# Altium schematic sheet Relay Control.SchDoc
size A2; SheetNumber: 1; SheetTotal: 1
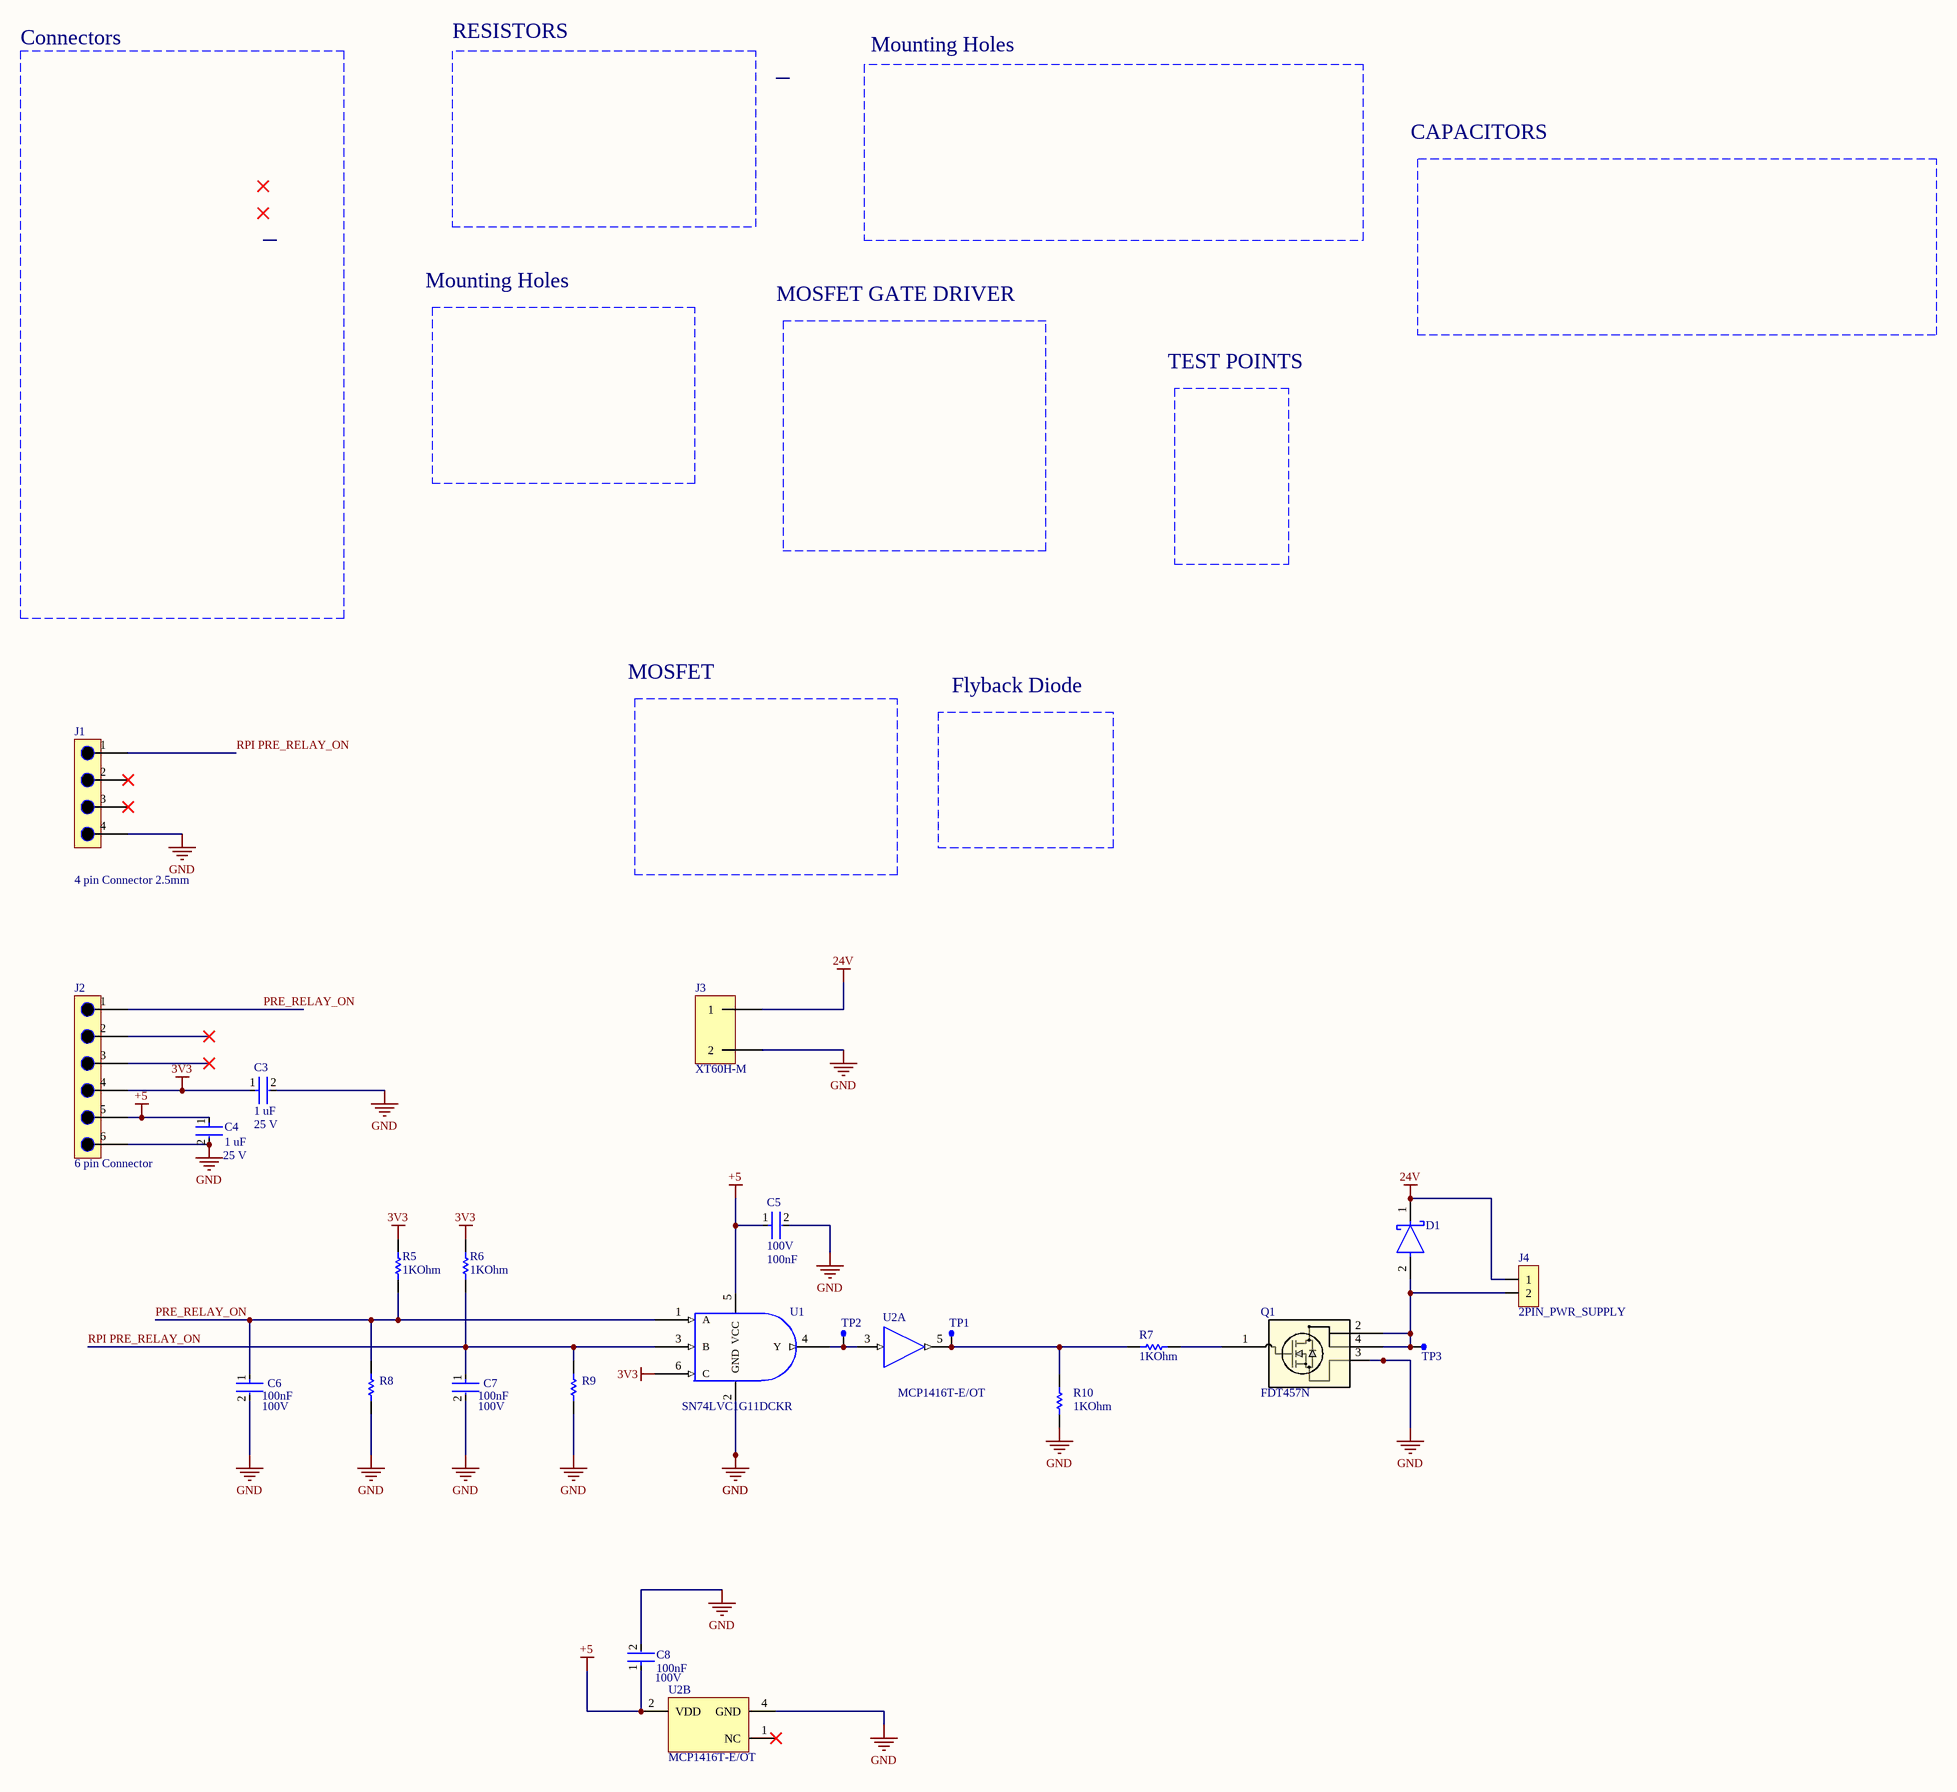
[diagram p0: Relay Control.SchDoc]

## Parts
C3  Capacitance: 1 uF  Voltage Rating: 25 V  [FP-CC0805-0_85-MFG]  (hidden comment: CC0805KKX7R8BB105)
C4  Capacitance: 1 uF  Voltage Rating: 25 V  [FP-CC0805-0_85-MFG]  (hidden comment: CC0805KKX7R8BB105)
C5  Voltage Rating: 100V  Capacitance: 100nF  [FP-0805-L_2_0_0_1-W_1_25-MFG]  (hidden comment: HMK212B7104MG-T)
C6  Voltage Rating: 100V  Capacitance: 100nF  [FP-0805-L_2_0_0_1-W_1_25-MFG]  (hidden comment: HMK212B7104MG-T)
C7  Voltage Rating: 100V  Capacitance: 100nF  [FP-0805-L_2_0_0_1-W_1_25-MFG]  (hidden comment: HMK212B7104MG-T)
C8  Voltage Rating: 100V  Capacitance: 100nF  [FP-0805-L_2_0_0_1-W_1_25-MFG]  (hidden comment: HMK212B7104MG-T)
D1  NRVBSS14HE  [FP-477AD-MFG]  (value not drawn)
J1  4 pin Connector 2.5mm  [4 PIN CONNECTOR 2.5MM]
J2  6 pin Connector  [PLEASEWORK - 6 Pin connector 2.5mm spacing]
J3  XT60H-M  [XT60H-M]
J4  2PIN_PWR_SUPPLY  [2PIN_JST_CONNECTOR]
Q1  FDT457N  [FDT457N MOSFET]
R5  Resistance: 1KOhm  [RESC2013X60X35NL10T20]  (hidden comment: RC0805FR-071KL)
R6  Resistance: 1KOhm  [RESC2013X60X35NL10T20]  (hidden comment: RC0805FR-071KL)
R7  Resistance: 1KOhm  [RESC2013X60X35NL10T20]  (hidden comment: RC0805FR-071KL)
R8  RC0805FR-0710KL  [RESC2013X60X35NL10T20]  (value not drawn)
R9  RC0805FR-0710KL  [RESC2013X60X35NL10T20]  (value not drawn)
R10  Resistance: 1KOhm  [RESC2013X60X35NL10T20]  (hidden comment: RC0805FR-071KL)
TP1  TEST_POINT  [TEST_POINT]  (value not drawn)
TP2  TEST_POINT  [TEST_POINT]  (value not drawn)
TP3  TEST_POINT  [TEST_POINT]  (value not drawn)
U1  SN74LVC1G11DCKR  [AND GATE]
U2  MCP1416T-E/OT  [SOT-23-OT5_M]  (parts A,B of 2)

## Nets
3V3: C3.1 J2.4 R5.1 R6.1 U1.6(C)
24V: D1.1(C) J3.1 J4.1
+5: C4.1 C5.1 C8.1 J2.5 U1.5(VCC) U2.2(VDD)
GND: C3.2 C4.2 C5.2 C6.2 C7.2 C8.2 J1.4 J2.6 J3.2 Q1.3 R8.1 R9.1 R10.1 U1.2(GND) U2.4(GND)
PRE_RELAY_ON: C6.1 J2.1 R5.2 R8.2 U1.1(A)
RPI PRE_RELAY_ON: C7.1 J1.1 R6.2 R9.2 U1.3(B)
NetD1_2: D1.2(A) J4.2 Q1.2 Q1.4 TP3.1
NetQ1_1: Q1.1 R7.1
NetR7_2: R7.2 R10.2 TP1.1 U2.5(OUT)
NetTP2_1: TP2.1 U1.4(Y) U2.3(IN)

Not connected (* = marked no-connect by the designer): J1 2* 3*; J2 2* 3*; U2 1(NC)*

## Notes on the sheet
- Connectors
- RESISTORS
- Mounting Holes
- CAPACITORS
- MOSFET GATE DRIVER
- TEST POINTS
- MOSFET
- Flyback Diode

## Library data of the parts
C3 C4 = CMP-2100-03605-2: CAP CER 1UF 25V X7R 0805; Manufacturer: Yageo; Material: Ceramic; Tolerance: 0.1; Temperature Characteristic: X7R; RoHS: TRUE; Manufacturer Part Number: CC0805KKX7R8BB105; Value: 1 uF; Package: CC0805-0.85; Ipc Land Pattern Name: CAPC200125X85; Device Class L2: Capacitors; ComponentLink2URL: http://www.yageo.com/documents/recent/UPY-GPHC_Y5V_6.3V-to-50V_8.pdf; Height: 0.95mm; ComponentLink2Description: Datasheet; Automotive: No; Device Class L1: Passive Components; Lead Free: Yes; Temperature Range Low: -30°C; Digikey Description: CAP CER 1UF 25V X7R 0805; Temperature: -30°C to +85°C; Temperature Range High: +85°C; Category: Cap; Device Class L3: Ceramic Capacitors; Footprint Url: http://www.yageo.com/exep/pages/download/literatures/UPY-C_GEN_24.pdf; Octopart: https://octopart.com/cc0805kkx7r8bb105-yageo-42244645; Mouser Description: Multilayer Ceramic Capacitor, CC Series, 1 - F, - 10%, X7R, 25 V, 0805 [2012 Metric]
C5-C8 = CMP-14477-005100-2: Multilayer Ceramic Capacitor 0.1 uF 100V X7R 20% SMD 0805 T/R; Height: 1.25mm; RoHS Compliant: Yes; Construction: Flat; Width: 0.049inch; Series: M; Depth: 1.25mm; Case Code (Imperial): 0805; Dielectric: X7R; Resistor Type: Ceramic; Halogen Free: Halogen Free; Number of Pins: 2; Radiation Hardening: No; Max Operating Temperature: 125°C; Thickness: 0.053inch; Packaging: Tape and Reel; Package Quantity: 3000; Termination: SMD/SMT; Min Operating Temperature: -55°C; Mount: Surface Mount; Case/Package: 0805; Length: 2mm; Voltage Rating (DC): 100V; Tolerance: 20%; Case Code (Metric): 2012
D1 = CMP-00278-93203856-2: NRVBSS14HE Rectifier Diode, Schottky, 1 Phase, 1 Element, 1A, 40V V(RRM), Silicon; Manufacturer Lifecycle Status: ACTIVE; Capacitance: 55pF; Max Forward Surge Current (Ifsm): 25A; Peak Reverse Current: 5µA; Max Junction Temperature (Tj): 150°C; Forward Current: 1A; Min Operating Temperature: -55°C; NexarPartId: 93203856; Reverse Voltage: 40V; Max Operating Temperature: 150°C; RoHS: Compliant; Lifecycle Status: Production; Max Repetitive Reverse Voltage (Vrrm): 40V; Height: 750µm
J4 = 2PIN_PWR_SUPPLY: Number of Positions: 2; Mounting Type: Through Hole
Q1 = FDT457N: No Description Available; Mfr_Name: onsemi; Type: Current Regulation - Diodes, Transistors; RefDes: RefDes
R5-R7 R10 = CMP-2100-03671-1: Chip Resistor, 1 KOhm, +/- 1%, 125 mW, -55 to 155 degC, 0805 (2012 Metric), RoHS, Tape and Reel; Manufacturer: Yageo; Temperature Coefficient: 100ppm/degreesC; Voltage Rating (DC): 150V; Max Power Dissipation: 125mW; Number of Pins: 2; Number of Terminations: 2; Datasheet URL: http://www.yageo.com/NewPortal/yageodocoutput?fileName=/pdf/R-Chip/PYu-RC_Group_51_RoHS_L_5.pdf; Length: 0.079inch; Package Description: 2-Pin Surface Mounted Device, Body 2 x 1.25 mm; Depth: 1.25mm; Height: 0.024inch; Military Standard: Not; Case/Package: 0805; Package Reference: 0805; RoHSCompliant: true; Lead Free: LeadFree; Packaging: TapeandReel; Package Quantity: 1; Datasheet Version: Rev. 5, 10/2016; Tolerance: 1%; Min Operating Temperature: -55degC; Voltage Rating: 150V; Composition: ThickFilm; Case Code (Imperial): 0805; Power Rating: 125mW; Width: 0.049inch; Case Code (Metric): 2012; Manufacturer URL: http://www.yageo.com/; Max Operating Temperature: 155degC; REACH SVHC: Unknown; Termination: SMD/SMT
R8 R9 = CMP-1659-00013-4: Chip Resistor, 10 KOhm, +/- 1%, 0.125 W, -55 to 155 degC, 0805 (2012 Metric), RoHS, Tape and Reel; Manufacturer: Yageo; Voltage Rating: 150 V; Mount: Surface Mount; ComponentLink1Description: Manufacturer URL; ComponentLink2URL: http://www.yageo.com/documents/recent/PYu-RC_Group_51_RoHS_L_04.pdf; Pins: 2; Length: 2 mm; Min Operating Temperature: -55 degC; Height: 0.5 mm; Mounting Technology: Surface Mount; RoHSCompliant: true; REACH SVHC: No SVHC; ComponentLink1URL: http://www.yageo.com/; Max Operating Temperature: 155 degC; PackageReference: 0805; DatasheetVersion: Rev. 4, 02/2016; Package Quantity: 5000; Packaging: Tape and Reel; ComponentLink2Description: Datasheet; PackageDescription: 2-Pin Surface Mounted Device, Body 2 x 1.25 mm
TP1-TP3 = TESTING_POINT
U1 = SN74LVC1G11DCKR: No Description Available; Mfr_Name: Texas Instruments; RefDes: RefDes; Type: Type
U2 = CMP-0137-00410-1: Tiny 1.5A, High-Speed Power MOSFET Driver, Non Inverting, Extended Temperature, Tape and Reel; PackageDescription: 5-Lead Plastic Small Outline Transistor (OT) [SOT-23]; Code_IPC: SOT23-5; PackageVersion: revBB, Aug-2009; PackageReference: SOT-23-OT5; DatasheetVersion: revC, Dec-2008